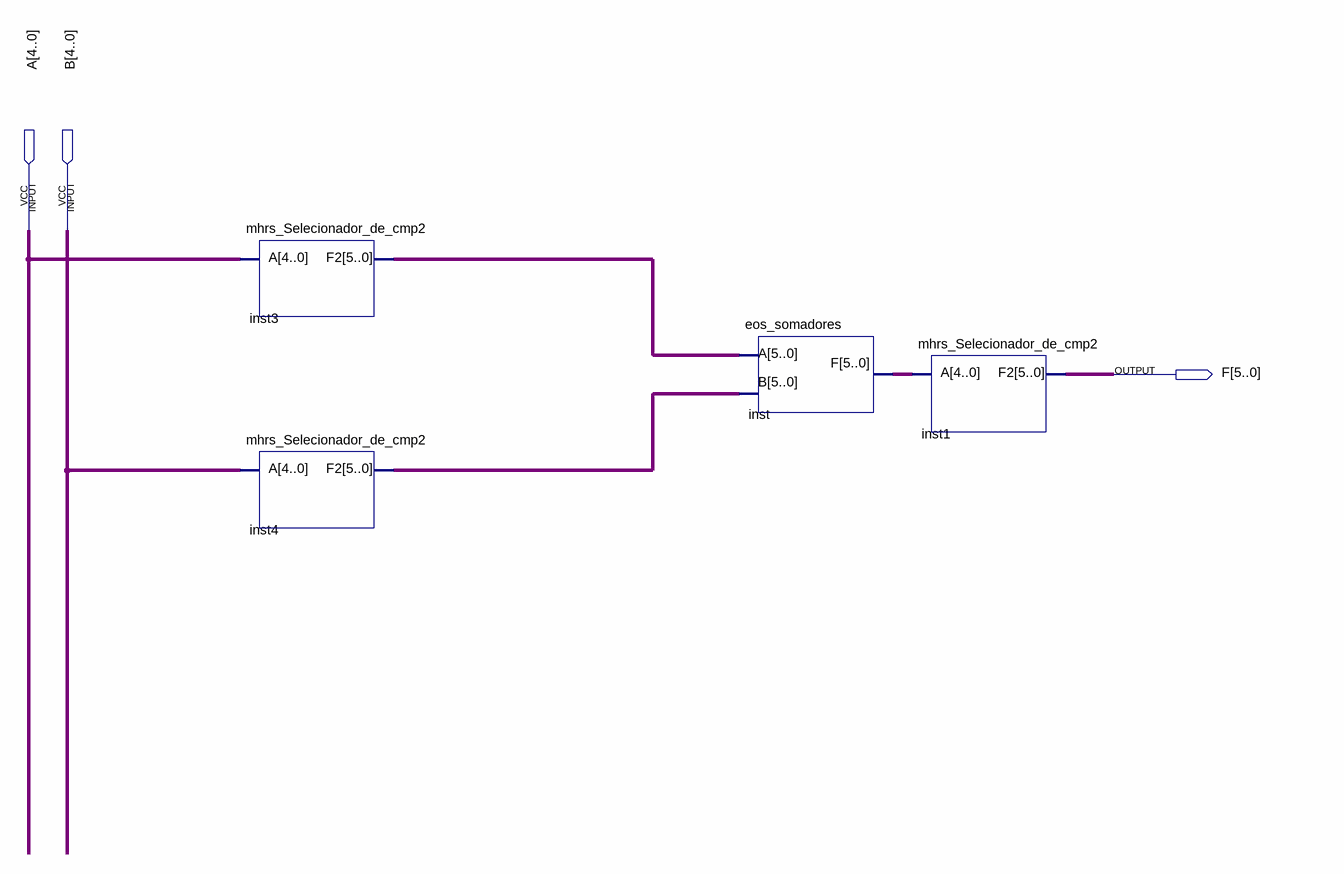
[diagram p0: schematic sheet]
// Quartus schematic eos_A_mais_B.bdf as structural Verilog: 4 symbols, 3 pins
module eos_A_mais_B (
  input  [4:0] A,
  input  [4:0] B,
  output [5:0] F
);

  wire [5:0] inst3_f2, inst4_f2, inst_f;

  mhrs_Selecionador_de_cmp2 inst3 (.A(A), .F2(inst3_f2));
  mhrs_Selecionador_de_cmp2 inst4 (.A(B), .F2(inst4_f2));
  eos_somadores inst (.A(inst3_f2), .B(inst4_f2), .F(inst_f));
  mhrs_Selecionador_de_cmp2 inst1 (.A(inst_f), .F2(F));
endmodule
